# Altium schematic sheet ESP32-HWE-Uno.SchDoc
size A4; SheetNumber: 1; SheetTotal: 1
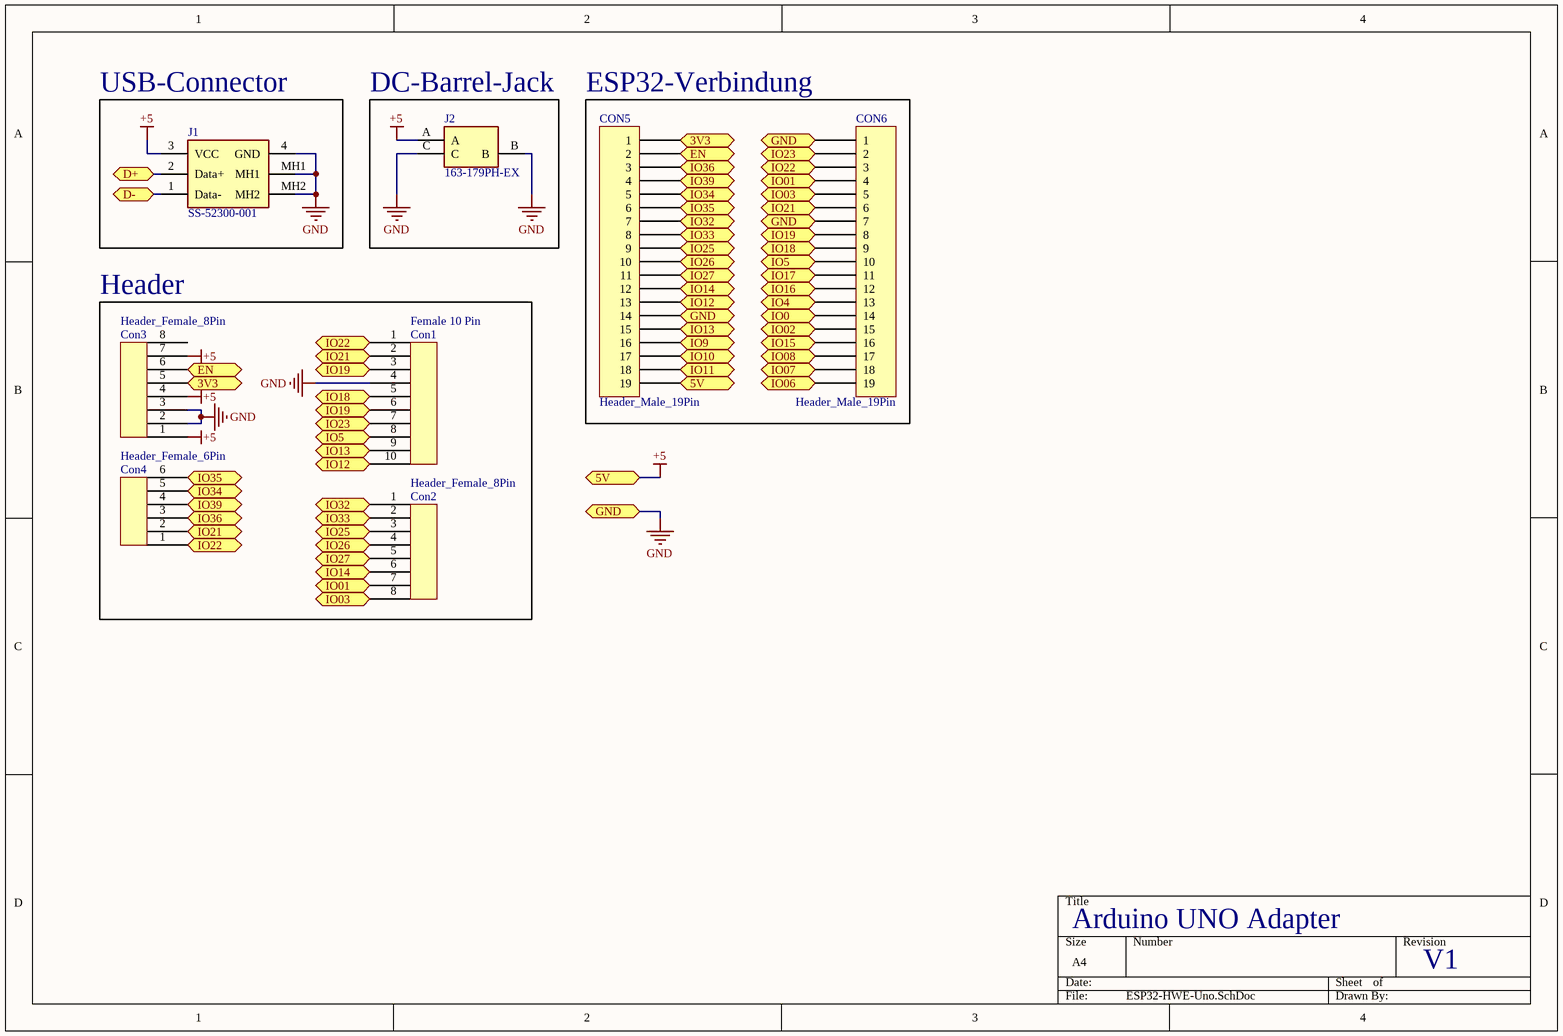
[diagram p0: ESP32-HWE-Uno.SchDoc]

## Parts
Con1  Female 10 Pin  [Header_Female_10Pin]
Con2  Header_Female_8Pin  [Header_Female_8Pin]
Con3  Header_Female_8Pin  [Header_Female_8Pin]
Con4  Header_Female_6Pin  [Header_Female_6Pin]
CON5  Header_Male_19Pin  [Male_Header19Pin]
CON6  Header_Male_19Pin  [Male_Header19Pin]
J1  SS-52300-001  [SS52300001]
J2  163-179PH-EX  [163179PHEX]

## Blocks framed on the sheet
USB-Connector: J1
DC-Barrel-Jack: J2
ESP32-Verbindung: CON5 CON6
Header: Con1-Con4

## Ports
3V3 (bidir, see ESP32-HWE-Uno[1B]), 3V3 (bidir, see ESP32-HWE-Uno[2A]), 5V (bidir, see ESP32-HWE-Uno[2B]), D+ (bidir), D- (bidir), EN (bidir, see ESP32-HWE-Uno[1B]), EN (bidir, see ESP32-HWE-Uno[2A]), GND (bidir, see ESP32-HWE-Uno[2A], ESP32-HWE-Uno[2B]), IO0 (bidir), IO01 (bidir, see ESP32-HWE-Uno[1C]), IO01 (bidir, see ESP32-HWE-Uno[2A]), IO02 (bidir), IO03 (bidir, see ESP32-HWE-Uno[1C]), IO03 (bidir, see ESP32-HWE-Uno[2A]), IO4 (bidir), IO5 (bidir, see ESP32-HWE-Uno[1B]), IO5 (bidir, see ESP32-HWE-Uno[2B]), IO06 (bidir), IO07 (bidir), IO08 (bidir), IO9 (bidir), IO10 (bidir), IO11 (bidir), IO12 (bidir, see ESP32-HWE-Uno[1B]), IO12 (bidir, see ESP32-HWE-Uno[2B]), IO13 (bidir, see ESP32-HWE-Uno[1B]), IO13 (bidir, see ESP32-HWE-Uno[2B]), IO14 (bidir, see ESP32-HWE-Uno[1C]), IO14 (bidir, see ESP32-HWE-Uno[2B]), IO15 (bidir), IO16 (bidir), IO17 (bidir), IO18 (bidir, see ESP32-HWE-Uno[1B]), IO18 (bidir, see ESP32-HWE-Uno[2A]), IO19 (bidir, see ESP32-HWE-Uno[1B]), IO19 (bidir, see ESP32-HWE-Uno[1B], ESP32-HWE-Uno[2A]), IO21 (bidir, see ESP32-HWE-Uno[1B], ESP32-HWE-Uno[1C]), IO21 (bidir, see ESP32-HWE-Uno[1B], ESP32-HWE-Uno[2A]), IO21 (bidir, see ESP32-HWE-Uno[1C], ESP32-HWE-Uno[2A]), IO22 (bidir, see ESP32-HWE-Uno[1B], ESP32-HWE-Uno[1C]), IO22 (bidir, see ESP32-HWE-Uno[1B], ESP32-HWE-Uno[2A]), IO22 (bidir, see ESP32-HWE-Uno[1C], ESP32-HWE-Uno[2A]), IO23 (bidir, see ESP32-HWE-Uno[1B]), IO23 (bidir, see ESP32-HWE-Uno[2A]), IO25 (bidir, see ESP32-HWE-Uno[1C]), IO25 (bidir, see ESP32-HWE-Uno[2A]), IO26 (bidir, see ESP32-HWE-Uno[1C]), IO26 (bidir, see ESP32-HWE-Uno[2B]), IO27 (bidir, see ESP32-HWE-Uno[1C]), IO27 (bidir, see ESP32-HWE-Uno[2B]), IO32 (bidir, see ESP32-HWE-Uno[1B]), IO32 (bidir, see ESP32-HWE-Uno[2A]), IO33 (bidir, see ESP32-HWE-Uno[1C]), IO33 (bidir, see ESP32-HWE-Uno[2A]), IO34 (bidir, see ESP32-HWE-Uno[1B]), IO34 (bidir, see ESP32-HWE-Uno[2A]), IO35 (bidir, see ESP32-HWE-Uno[1B]), IO35 (bidir, see ESP32-HWE-Uno[2A]), IO36 (bidir, see ESP32-HWE-Uno[1C]), IO36 (bidir, see ESP32-HWE-Uno[2A]), IO39 (bidir, see ESP32-HWE-Uno[1B]), IO39 (bidir, see ESP32-HWE-Uno[2A])

## Nets
+5: Con3.1 Con3.4 Con3.7 CON5.19 J1.3(VCC) J2.A ; port 5V
GND: Con1.4 Con3.2 Con3.3 CON5.14 CON6.1 CON6.7 J1.4(GND) J1.MH1 J1.MH2 J2.B J2.C ; port GND
3V3: Con3.5 CON5.1 ; port 3V3
D+: J1.2(Data+) ; port D+
D-: J1.1(Data-) ; port D-
EN: Con3.6 CON5.2 ; port EN
IO0: CON6.14 ; port IO0
IO01: Con2.7 CON6.4 ; port IO01
IO02: CON6.15 ; port IO02
IO03: Con2.8 CON6.5 ; port IO03
IO4: CON6.13 ; port IO4
IO5: Con1.8 CON6.10 ; port IO5
IO06: CON6.19 ; port IO06
IO07: CON6.18 ; port IO07
IO08: CON6.17 ; port IO08
IO9: CON5.16 ; port IO9
IO10: CON5.17 ; port IO10
IO11: CON5.18 ; port IO11
IO12: Con1.10 CON5.13 ; port IO12
IO13: Con1.9 CON5.15 ; port IO13
IO14: Con2.6 CON5.12 ; port IO14
IO15: CON6.16 ; port IO15
IO16: CON6.12 ; port IO16
IO17: CON6.11 ; port IO17
IO18: Con1.5 CON6.9 ; port IO18
IO19: Con1.3 Con1.6 CON6.8 ; port IO19
IO21: Con1.2 Con4.2 CON6.6 ; port IO21
IO22: Con1.1 Con4.1 CON6.3 ; port IO22
IO23: Con1.7 CON6.2 ; port IO23
IO25: Con2.3 CON5.9 ; port IO25
IO26: Con2.4 CON5.10 ; port IO26
IO27: Con2.5 CON5.11 ; port IO27
IO32: Con2.1 CON5.7 ; port IO32
IO33: Con2.2 CON5.8 ; port IO33
IO34: Con4.5 CON5.5 ; port IO34
IO35: Con4.6 CON5.6 ; port IO35
IO36: Con4.3 CON5.3 ; port IO36
IO39: Con4.4 CON5.4 ; port IO39

Not connected (* = marked no-connect by the designer): Con3 8

## Notes on the sheet
- Arduino UNO Adapter
- V1

## Library data of the parts
Con1 = Header_Female_10Pin
J1 = SS-52300-001: Connector; Manufacturer_Name: Bel; Datasheet Link: https://belfuse.com/resources/datasheets/stewartconnector/ds-stw-usb-2.0-type-b-connectors.pdf; Height: 10.82mm; Manufacturer_Part_Number: SS-52300-001; Mouser Part Number: 530-SS-52300-001
J2 = 163-179PH-EX: Connector; Manufacturer_Name: Kobiconn; Datasheet Link: https://componentsearchengine.com/Datasheets/1/163-179PH-EX.pdf; Height: 11mm; Manufacturer_Part_Number: 163-179PH-EX; Mouser Part Number: 163-179PH-EX; Mouser Price/Stock: https://www.mouser.co.uk/ProductDetail/Kobiconn/163-179PH-EX?qs=Xb8IjHhkxj5l2UOaIqcGCw%3D%3D